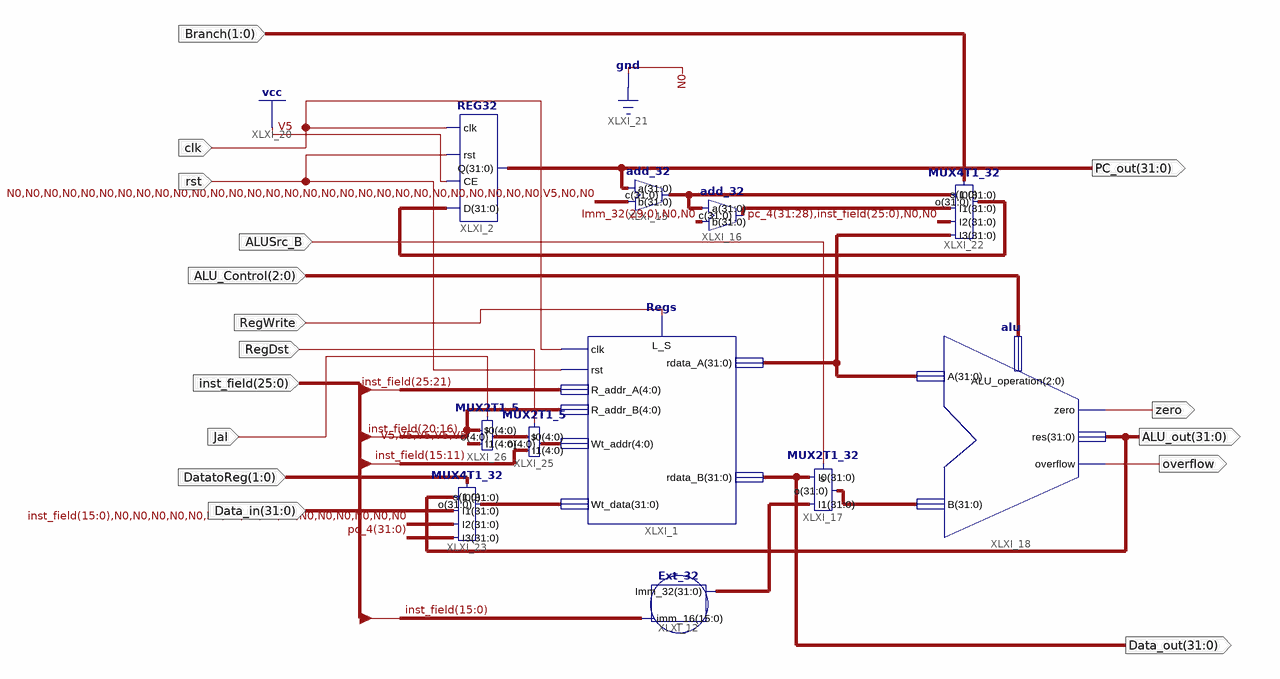
[diagram p0: schematic sheet 1]
// Xilinx ISE schematic Data_path_More.sch (kintex7) as structural Verilog: 11 symbols, 16 ports
module Data_path_More (
  input  RegDst,
  input  [1:0] DatatoReg,
  input  [31:0] Data_in,
  input  [25:0] inst_field,
  input  [2:0] ALU_Control,
  input  clk,
  input  rst,
  input  RegWrite,
  input  ALUSrc_B,
  input  Jal,
  input  [1:0] Branch,
  output [31:0] Data_out,
  output [31:0] PC_out,
  output [31:0] ALU_out,
  output zero,
  output overflow
);

  wire [4:0] XLXN_117, XLXN_118;
  wire [31:0] Imm_32, pc_4, RegAddr, XLXN_37, XLXN_38, XLXN_73, XLXN_79;

  Regs XLXI_1 (
    .clk(clk), .L_S(RegWrite), .rdata_A(XLXN_38), .rst(rst), .Wt_data(RegAddr), .rdata_B(Data_out),
    .R_addr_A(inst_field[25:21]), .R_addr_B(inst_field[20:16]), .Wt_addr(XLXN_118));
  Ext_32 XLXI_12 (.imm_16(inst_field[15:0]), .Imm_32(Imm_32));
  add_32 XLXI_15 (.c(pc_4), .a(PC_out), .b(32'b00000000000000000000000000000100));
  alu XLXI_18 (.zero(zero), .res(ALU_out), .overflow(overflow), .A(XLXN_38), .B(XLXN_37), .ALU_operation(ALU_Control));
  MUX2T1_32 XLXI_17 (.s(ALUSrc_B), .I0(Data_out), .I1(Imm_32), .o(XLXN_37));
  add_32 XLXI_16 (.c(XLXN_73), .a(pc_4), .b({Imm_32[29:0], 2'b00}));
  REG32 XLXI_2 (.D(XLXN_79), .CE(1'b1), .rst(rst), .clk(clk), .Q(PC_out));
  MUX4T1_32 XLXI_22 (
    .s(Branch), .I0(pc_4), .I1(XLXN_73), .I2({pc_4[31:28], inst_field, 2'b00}), .I3(XLXN_38), .o(XLXN_79));
  MUX4T1_32 XLXI_23 (
    .s(DatatoReg), .I0(ALU_out), .I1(Data_in), .I2({inst_field[15:0], {16{1'b0}}}), .I3(pc_4), .o(RegAddr));
  MUX2T1_5 XLXI_25 (.I1(inst_field[15:11]), .I0(XLXN_117), .o(XLXN_118), .s(RegDst));
  MUX2T1_5 XLXI_26 (.I1({5{1'b1}}), .I0(inst_field[20:16]), .o(XLXN_117), .s(Jal));
endmodule
